# Altium project UHF Transceiver.PrjPCB (part 2 of 3)

## Sheet ADF7021 Transceiver.SchDoc: ADF7021 Transceiver
size Letter; SheetNumber: 2; SheetTotal: 11
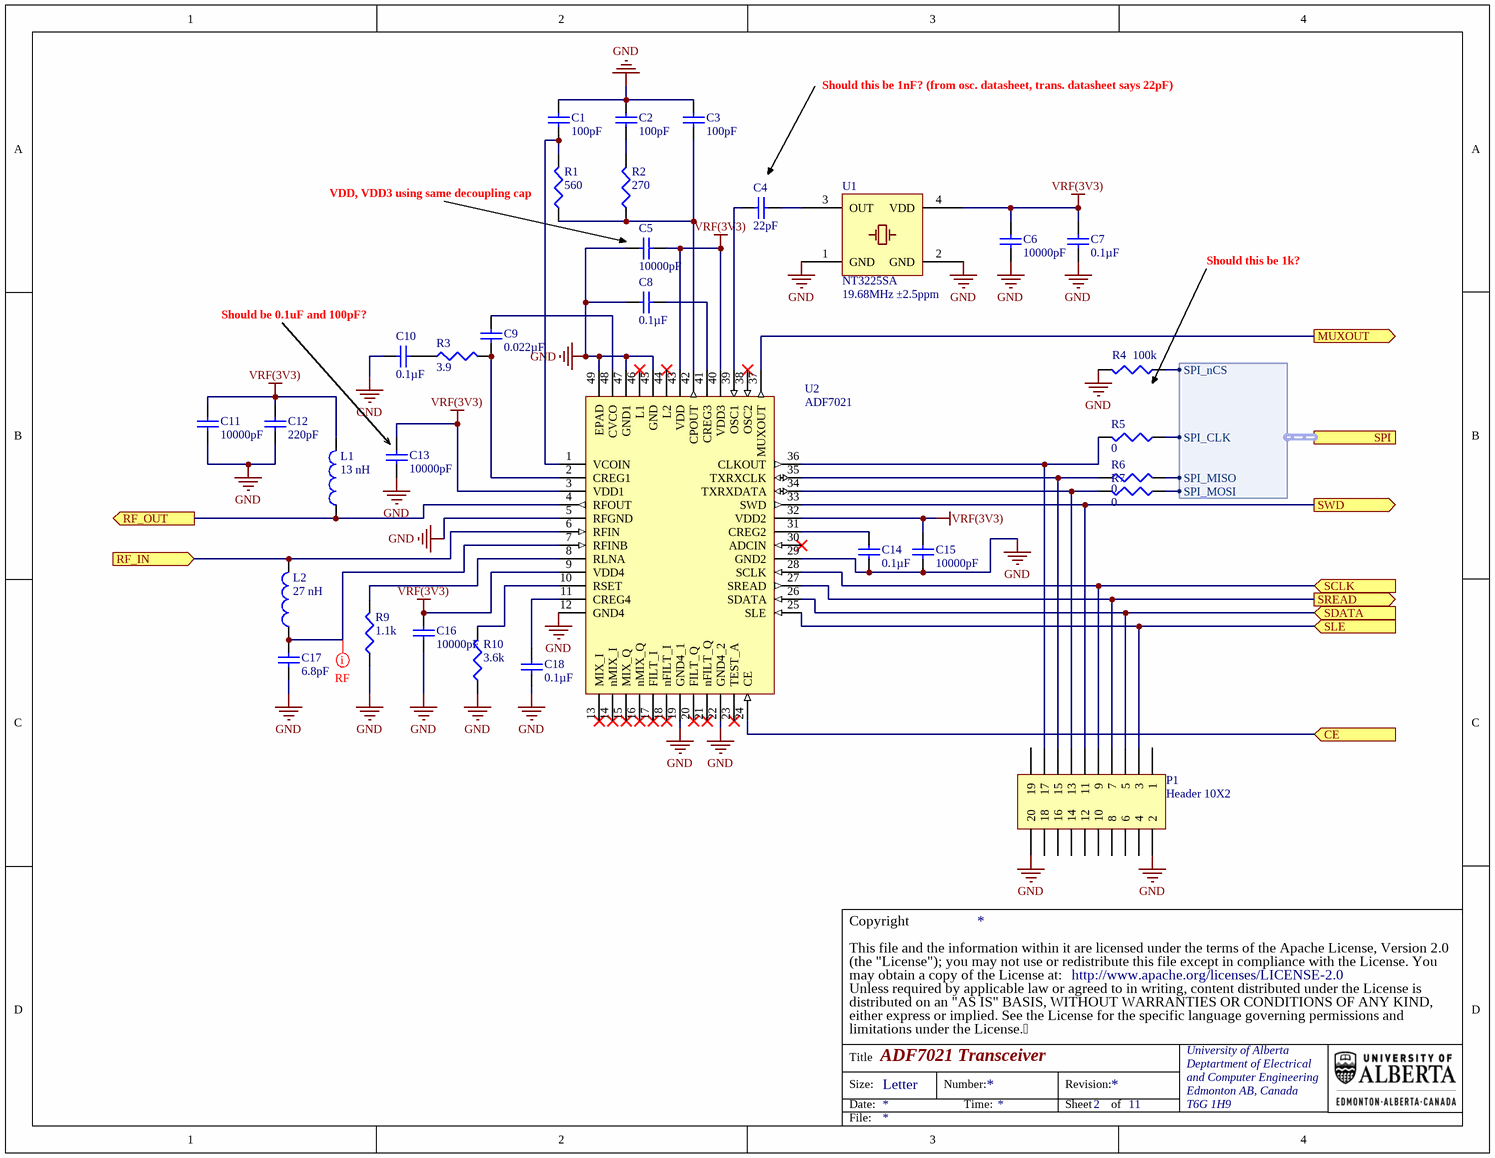
[diagram p3: ADF7021 Transceiver.SchDoc]

### Parts
C1  value 100pF  [TDK-CGA2B]  (hidden comment: Cap)
C2  value 100pF  [TDK-CGA2B]  (hidden comment: Cap)
C3  value 100pF  [TDK-CGA2B]  (hidden comment: Cap)
C4  value 22pF  [ATC-600L]  (hidden comment: Cap)
C5  value 10000pF  [TDK-CGA2B]  (hidden comment: Cap)
C6  value 10000pF  [TDK-CGA2B]  (hidden comment: Cap)
C7  value 0.1µF  [TDK-CGA2B]  (hidden comment: Cap)
C8  value 0.1µF  [TDK-CGA2B]  (hidden comment: Cap)
C9  value 0.022µF  [TDK-CGA2B]  (hidden comment: Cap)
C10  value 0.1µF  [TDK-CGA2B]  (hidden comment: Cap)
C11  value 10000pF  [TDK-CGA2B]  (hidden comment: Cap)
C12  value 220pF  [TDK-CGA2B]  (hidden comment: Cap)
C13  value 10000pF  [TDK-CGA2B]  (hidden comment: Cap)
C14  value 0.1µF  [TDK-CGA2B]  (hidden comment: Cap)
C15  value 10000pF  [TDK-CGA2B]  (hidden comment: Cap)
C16  value 10000pF  [TDK-CGA2B]  (hidden comment: Cap)
C17  value 6.8pF  [ATC-600L]  (hidden comment: Cap)
C18  value 0.1µF  [TDK-CGA2B]  (hidden comment: Cap)
L1  value 13 nH  [CCI-0402CS]  (hidden comment: 0402CS-13NXJLU)
L2  value 27 nH  [CCI-0402CS]  (hidden comment: 0402CS-27NXJLU)
P1  Header 10X2  [MOLX-0555600207]
R1  value 560  [PANA-ERA2A]  (hidden comment: Res3)
R2  value 270  [PANA-ERA2A]  (hidden comment: Res3)
R3  value 3.9  [VSH-CRCW0402]  (hidden comment: Res3)
R4  value 100k  [PANA-ERJ2R]  (hidden comment: Res3)
R5  value 0  [PANA-ERJ2G]  (hidden comment: Jumper)
R6  value 0  [PANA-ERJ2G]  (hidden comment: Jumper)
R7  value 0  [PANA-ERJ2G]  (hidden comment: Jumper)
R9  value 1.1k  [PANA-ERA2A]  (hidden comment: Res3)
R10  value 3.6k  [PANA-ERA2A]  (hidden comment: Res3)
U1  NT3225SA  value 19.68MHz  Frequency Stability: ±2.5ppm  [NDK-NT3225SA]
U2  ADF7021  [ADI-CP-48-5]

### Ports
CE (in), MUXOUT (out), RF_IN (in), RF_OUT (out), SCLK (in), SDATA (in), SLE (in), SPI (harness ADF7021_SPI), SREAD (out), SWD (out)

### Harnesses
ADF7021_SPI: SPI_MOSI, SPI_MISO, SPI_nCS, SPI_CLK

### Nets
GND: C1.2 C2.2 C3.2 C5.1 C6.1 C7.1 C8.2 C10.2 C11.1 C12.1 C13.1 C14.2 C15.1 C16.1 C17.1 C18.2 P1.2 P1.20 R4.2 R9.1 R10.1 U1.1(GND) U1.2(GND) U2.5(RFGND) U2.12(GND4) U2.19(GND4_1) U2.22(GND4_2) U2.29(GND2) U2.45(GND) U2.47(GND1) U2.49(EPAD)
VRF(3V3): C5.2 C6.2 C7.2 C11.2 C12.2 C13.2 C15.2 C16.2 L1.2 U1.4(VDD) U2.3(VDD1) U2.9(VDD4) U2.32(VDD2) U2.40(VDD3) U2.43(VDD)
ECAP6: R4.1 ; port SPI.SPI_nCS
EPWM1A: U2.24(CE) ; port CE
EPWM1B: P1.5 U2.26(SDATA) ; port SDATA
EPWM2A: P1.3 U2.25(SLE) ; port SLE
EQEP2I: U2.37(MUXOUT) ; port MUXOUT
GIOA0: P1.7 U2.27(SREAD) ; port SREAD
GIOA1: P1.11 U2.33(SWD) ; port SWD
GIOB0: P1.9 U2.28(SCLK) ; port SCLK
P93: R7.1 ; port SPI.SPI_MOSI
P94: R6.2 ; port SPI.SPI_MISO
P95: R5.1 ; port SPI.SPI_CLK
NetC1_1: C1.1 R1.2 U2.1(VCOIN)
NetC2_1: C2.1 R2.2
NetC3_1: C3.1 R1.1 R2.1 U2.42(CPOUT)
NetC4_1: C4.1 U2.39(OSC1)
NetC4_2: C4.2 U1.3(OUT)
NetC8_1: C8.1 U2.41(CREG3)
NetC9_1: C9.1 R3.2 U2.2(CREG1)
NetC9_2: C9.2 U2.48(CVCO)
NetC10_1: C10.1 R3.1
NetC14_1: C14.1 U2.31(CREG2)
NetC17_2: C17.2 L2.1 U2.7(RFINB)
NetC18_1: C18.1 U2.11(CREG4)
NetC52_2: L2.2 U2.6(RFIN) ; port RF_IN
NetC56_2: L1.1 U2.4(RFOUT) ; port RF_OUT
NetP1_13: P1.13 R7.2 U2.34(TXRXDATA)
NetP1_15: P1.15 R6.1 U2.35(TXRXCLK)
NetP1_17: P1.17 R5.2 U2.36(CLKOUT)
NetR9_2: R9.2 U2.8(RLNA)
NetR10_2: R10.2 U2.10(RSET)

Not connected (* = marked no-connect by the designer): P1 1 4 6 8 10 12 14 16 18 19; U2 13(MIX_I)* 14(nMIX_I)* 15(MIX_Q)* 16(nMIX_Q)* 17(FILT_I)* 18(nFILT_I)* 20(FILT_Q)* 21(nFILT_Q)* 23(TEST_A)* 30(ADCIN)* 38(OSC2)* 44(L2)* 46(L1)*

### Layout directives
net class RF; rule Impedance Constraint [Min = 50.00    Max = 50.00    ]: NetC17_2

### Notes on the sheet
- Should this be 1nF? (from osc. datasheet, trans. datasheet says 22pF)
- (near R1) VDD, VDD3 using same decoupling cap
- Should this be 1k?
- (near C10) Should be 0.1uF and 100pF?
- (the "License"); you may not use or redistribute this file except in compliance with the License. You
- This file and the information within it are licensed under the terms of the Apache License, Version 2.0
- Copyright
- Unless required by applicable law or agreed to in writing, content distributed under the License is
- distributed on an "AS IS" BASIS, WITHOUT WARRANTIES OR CONDITIONS OF ANY KIND,
- either express or implied. See the License for the specific language governing permissions and
- limitations under the License.
- may obtain a copy of the License at:
- http://www.apache.org/licenses/LICENSE-2.0
- Title
- Size:
- Date:
- Letter
- Number:
- Time:
- Revision:
- Sheet
- of
- University of Alberta
- Deptartment of Electrical
- and Computer Engineering
- Edmonton AB, Canada
- T6G 1H9
- File:

### Library data of the parts
C1-C3 = PC-TDK-01226: CAP CER 100PF 100V C0G 0402; Manufacturer Part Number: CGA2B2C0G2A101J050BA; Index: 1226; Designator: C?; Tolerance: ±5%; Temperature Coefficient: NP0; Published: 2016-03-16; LatestRevisionDate: 2016-03-16; LatestRevisionNote: ...; PackageReference: 0402 (1005 Metric); Publisher: AlbertaSat; PackageDescription: Radial Cap, Thru-Hole; 2 Leads; 0.3 in Pin Spacing; Part Number: PC-TDK-01226; Supplier Part Number 1: 445-15510-1-ND; Supplier 1: Digi-key; Supplier Link: http://www.digikey.ca/product-search/en?keywords=445-15510-1-ND; Voltage - Rated: 100V; Applications: Automotive
C4 = PC-ATC-00281: CAP CER 22PF 200V C0G/NP0 0402; Manufacturer Part Number: 600L220FT200T; Index: 281; Designator: C?; Tolerance: ±1%; Temperature Coefficient: C0G, NP0; Published: 2018-08-29; LatestRevisionDate: 2018-08-29; LatestRevisionNote: ...; PackageReference: 0402 (1005 Metric); Publisher: AlbertaSat; PackageDescription: Chip Capacitor, 2-Leads, Body 1.02x0.51mm, IPC Low Density; Part Number: PC-ATC-00281; Supplier Part Number 1: 1284-1114-1-ND; Supplier 1: Digi-key; Supplier Link: https://www.digikey.ca/products/en?keywords=1284-1114-1-ND; Voltage - Rated: 200V; Applications: High Q, Low Loss, Ultra Low ESR
C5 C6 C11 C13 C15 C16 = PC-TDK-01877: CAP CER 10000PF 50V X8R 0402; Manufacturer Part Number: CGA2B3X8R1H103K050BB; Index: 1877; Designator: C?; Tolerance: ±10%; Published: 2016-03-16; LatestRevisionDate: 2016-03-16; LatestRevisionNote: ...; PackageReference: 0402 (1005 Metric); Publisher: AlbertaSat; PackageDescription: Radial Cap, Thru-Hole; 2 Leads; 0.3 in Pin Spacing; Part Number: PC-TDK-01877; Supplier Part Number 1: 445-12303-1-ND; Supplier 1: Digi-key; Supplier Link: http://www.digikey.ca/product-search/en?keywords=445-12303-1-ND; Voltage - Rated: 50V; Temperature Coefficient: X8R; Applications: Automotive
C7 C8 C10 C14 C18 = PC-TDK-02259: CAP CER 0.1UF 50V X7R 0402; Manufacturer Part Number: CGA2B3X7R1H104K050BB; Index: 2259; Designator: C?; Tolerance: ±10%; Published: 2016-03-16; LatestRevisionDate: 2016-03-16; LatestRevisionNote: ...; PackageReference: 0402 (1005 Metric); Publisher: AlbertaSat; PackageDescription: Radial Cap, Thru-Hole; 2 Leads; 0.3 in Pin Spacing; Part Number: PC-TDK-02259; Supplier Part Number 1: 445-6899-1-ND; Supplier 1: Digi-key; Supplier Link: http://www.digikey.ca/product-search/en?keywords=445-6899-1-ND; Voltage - Rated: 50V; Temperature Coefficient: X7R; Applications: Automotive
C9 = PC-TDK-01998: CAP CER 0.022UF 50V X7R 0402; Manufacturer Part Number: CGA2B3X7R1H223K050BB; Index: 1998; Designator: C?; Tolerance: ±10%; Published: 2016-03-16; LatestRevisionDate: 2016-03-16; LatestRevisionNote: ...; PackageReference: 0402 (1005 Metric); Publisher: AlbertaSat; PackageDescription: Radial Cap, Thru-Hole; 2 Leads; 0.3 in Pin Spacing; Part Number: PC-TDK-01998; Supplier Part Number 1: 445-6895-1-ND; Supplier 1: Digi-key; Supplier Link: http://www.digikey.ca/product-search/en?keywords=445-6895-1-ND; Voltage - Rated: 50V; Temperature Coefficient: X7R; Applications: Automotive
C12 = PC-TDK-01303: CAP CER 220PF 50V NP0 0402; Manufacturer Part Number: CGA2B2NP01H221J050BA; Index: 1303; Designator: C?; Tolerance: ±5%; Published: 2016-03-16; LatestRevisionDate: 2016-03-16; LatestRevisionNote: ...; PackageReference: 0402 (1005 Metric); Publisher: AlbertaSat; PackageDescription: Radial Cap, Thru-Hole; 2 Leads; 0.3 in Pin Spacing; Part Number: PC-TDK-01303; Supplier Part Number 1: 445-12129-1-ND; Supplier 1: Digi-key; Supplier Link: http://www.digikey.ca/product-search/en?keywords=445-12129-1-ND; Voltage - Rated: 50V; Temperature Coefficient: NP0; Applications: Automotive
C17 = PC-ATC-00200: CAP CER 6.8PF 200V C0G/NP0 0402; Manufacturer Part Number: 600L6R8BT200T; Index: 200; Designator: C?; Tolerance: ±0.1pF; Temperature Coefficient: C0G, NP0; Published: 2018-08-29; LatestRevisionDate: 2018-08-29; LatestRevisionNote: ...; PackageReference: 0402 (1005 Metric); Publisher: AlbertaSat; PackageDescription: Chip Capacitor, 2-Leads, Body 1.02x0.51mm, IPC Low Density; Part Number: PC-ATC-00200; Supplier Part Number 1: 1284-1134-1-ND; Supplier 1: Digi-key; Supplier Link: https://www.digikey.ca/products/en?keywords=1284-1134-1-ND; Voltage - Rated: 200V; Applications: High Q, Low Loss, Ultra Low ESR
L1 = PL-CCI-00008: Fixed Inductors 0402CS AEC-Q200 13 nH 5 % 0.44 A; Code_IEC: 1005; Index: 8; Designator: L?; Published: 2018-06-17; LatestRevisionDate: 2018-06-17; LatestRevisionNote: ...; PackageReference: 0402 (1005 Metric); Publisher: AlbertaSat; PackageDescription: Chip Inductor, 2-Leads, Body 1.02x0.51mm, IPC Low Density; Code_JEITA: 0402; Part Number: PL-CCI-00008; Manufacturer Part Number: 0402CS-13NXJLU; Supplier Part Number 1: 994-0402CS-13NXJLU; Supplier 1: Mouser; Supplier Part Number 2: 0402CS-13NXJLU; Supplier 2: Coilcraft Direct; Supplier Link: #https://www.mouser.ca/ProductDetail/Coilcraft/0402CS-13NXJLU?qs=sGAEpiMZZMsg%252by3WlYCkU2kWFds1hA9D8Sdb1F7tpJw=#
L2 = PL-CCI-00009: Fixed Inductors 0402CS AEC-Q200 27 nH 5 % 0.4 A / Fixed Inductors 0402CS AEC-Q200 27 nH 5 % 0.4 A; Code_IEC: 1005; Index: 9; Designator: L?; Published: 2018-06-17; LatestRevisionDate: 2018-06-17; LatestRevisionNote: ...; PackageReference: 0402 (1005 Metric); Publisher: AlbertaSat; PackageDescription: Chip Inductor, 2-Leads, Body 1.02x0.51mm, IPC Low Density; Code_JEITA: 0402; Part Number: PL-CCI-00009; Manufacturer Part Number: 0402CS-27NXJLU; Supplier Part Number 1: 994-0402CS-27NXJLU; Supplier 1: Mouser; Supplier Part Number 2: 0402CS-27NXJLU; Supplier 2: Coilcraft Direct; Supplier Link: #https://www.mouser.ca/ProductDetail/Coilcraft/0402CS-27NXJLU?qs=sGAEpiMZZMsg%252by3WlYCkU2kWFds1hA9DQUyEMcwWJWI%3d#
P1 = 50: CONN PLUG 20POS 1.5MM SMD .5MM; Part Number: 50; Manufacturer Part Number: 0555600207; Designator: P?; LatestRevisionDate: 17-Jul-2002; LatestRevisionNote: Re-released for DXP Platform.; Publisher: Altium Limited; Supplier Part Number 1: WM9217CT-ND; Supplier 1: Digi-Key; Supplier Link: #https://www.digikey.ca/product-detail/en/molex-llc/0555600207/WM9217CT-ND/1025137#; PackageReference: MOLX-0555600207
R1 = 15042: RES SMD 560 OHM 0.1% 1/16W 0402; Part Number: 15042; Manufacturer Part Number: ERA-2ARB561X; Designator: R?; Power: 0.063W, 1/16W; Temperature Coefficient: ±10ppm/°C; Published: 8-Jun-2000; LatestRevisionDate: 29-May-2009; LatestRevisionNote: IPC-7351 Footprint Added.; PackageReference: 0402 (1005 Metric); Publisher: Altium Limited; PackageDescription: Chip Resistor, 2-Leads, Body 1.00x0.50mm, IPC Low Density; Supplier Part Number 1: P560CPCT-ND; Supplier 1: Digi-Key; Supplier Link: http://www.digikey.ca/product-search/en?keywords=P560CPCT-ND; Tolerance: ±0.1%
R2 = 14593: RES SMD 270 OHM 0.1% 1/16W 0402; Part Number: 14593; Manufacturer Part Number: ERA-2ARB271X; Designator: R?; Power: 0.063W, 1/16W; Temperature Coefficient: ±10ppm/°C; Published: 8-Jun-2000; LatestRevisionDate: 29-May-2009; LatestRevisionNote: IPC-7351 Footprint Added.; PackageReference: 0402 (1005 Metric); Publisher: Altium Limited; PackageDescription: Chip Resistor, 2-Leads, Body 1.00x0.50mm, IPC Low Density; Supplier Part Number 1: P270CPCT-ND; Supplier 1: Digi-Key; Supplier Link: http://www.digikey.ca/product-search/en?keywords=P270CPCT-ND; Tolerance: ±0.1%
R3 = PR-VSH-00269: RES SMD 3.9 OHM 1% 1/16W 0402; Manufacturer Part Number: CRCW04023R90FKED; Index: 269; Designator: R?; Power - Rated: 0.063W; Temperature Coefficient: ±100ppm/°C; Published: 2018-12-11; LatestRevisionDate: 2018-12-11; LatestRevisionNote: ...; PackageReference: 0402 (1005 Metric); Publisher: AlbertaSat; PackageDescription: Chip Resistor, 2-Leads, Body 1.00x0.50mm, IPC Low Density; Part Number: PR-VSH-00269; Supplier Part Number 1: 541-3.90LLCT-ND; Supplier 1: Digi-key; Supplier Part Number 2: 71-CRCW04023R90FKED; Supplier 2: Mouser; Supplier Link: #https://www.digikey.ca/product-detail/en/vishay-dale/CRCW04023R90FKED/541-3.90LLCT-ND/1961949#; Tolerance: ±1%; Applications: Automotive
R4 = 18739: RES SMD 100K OHM 1% 1/10W 0402; Part Number: 18739; Manufacturer Part Number: ERJ-2RKF1003X; Designator: R?; Power: 0.1W, 1/10W; Temperature Coefficient: ±100ppm/°C; Published: 8-Jun-2000; LatestRevisionDate: 29-May-2009; LatestRevisionNote: IPC-7351 Footprint Added.; PackageReference: 0402 (1005 Metric); Publisher: Altium Limited; PackageDescription: Chip Resistor, 2-Leads, Body 1.00x0.50mm, IPC Low Density; Supplier Part Number 1: P100KLCT-ND; Supplier 1: Digi-Key; Supplier Link: http://www.digikey.ca/product-search/en?keywords=P100KLCT-ND; Tolerance: ±1%
R5-R7 = 13127: RES SMD 0.0OHM JUMPER 1/10W 0402; Part Number: 13127; Manufacturer Part Number: ERJ-2GE0R00X; Designator: R?; Power: 0.1W, 1/10W; PackageDescription: Chip Resistor, 2-Leads, Body 1.00x0.50mm, IPC Low Density; Supplier Part Number 1: P0.0JCT-ND; Supplier 1: Digi-Key; Supplier Link: http://www.digikey.ca/product-search/en?keywords=P0.0JCT-ND; PackageReference: 0402 (1005 Metric); Tolerance: Jumper; Temperature Coefficient: -; Type: Jumper
R9 = 15460: RES SMD 1.1K OHM 0.1% 1/16W 0402; Part Number: 15460; Manufacturer Part Number: ERA-2ARB112X; Designator: R?; Power: 0.063W, 1/16W; Temperature Coefficient: ±10ppm/°C; Published: 8-Jun-2000; LatestRevisionDate: 29-May-2009; LatestRevisionNote: IPC-7351 Footprint Added.; PackageReference: 0402 (1005 Metric); Publisher: Altium Limited; PackageDescription: Chip Resistor, 2-Leads, Body 1.00x0.50mm, IPC Low Density; Supplier Part Number 1: P1.1KCPCT-ND; Supplier 1: Digi-Key; Supplier Link: http://www.digikey.ca/product-search/en?keywords=P1.1KCPCT-ND; Tolerance: ±0.1%
R10 = 16432: RES SMD 3.6K OHM 0.1% 1/16W 0402; Part Number: 16432; Manufacturer Part Number: ERA-2ARB362X; Designator: R?; Power: 0.063W, 1/16W; Temperature Coefficient: ±10ppm/°C; Published: 8-Jun-2000; LatestRevisionDate: 29-May-2009; LatestRevisionNote: IPC-7351 Footprint Added.; PackageReference: 0402 (1005 Metric); Publisher: Altium Limited; PackageDescription: Chip Resistor, 2-Leads, Body 1.00x0.50mm, IPC Low Density; Supplier Part Number 1: P3.6KCPCT-ND; Supplier 1: Digi-Key; Supplier Link: http://www.digikey.ca/product-search/en?keywords=P3.6KCPCT-ND; Tolerance: ±0.1%
U1 = PU-NDK-00001: OSC VCTCXO 19.68MHZ SMD; Manufacturer Part Number: NT3225SA-19.680000MHZ; Index: 1; Designator: U?; Voltage - Supply: 3V; Current - Supply (Max): 1.5mA; Part Number: PU-NDK-00001; Supplier Part Number 1: 644-1088-1-ND; Supplier 1: Digi-key; Supplier Part Number 2: NT3225SA-19.680000MHZ; Supplier 2: Excess Parts; Publisher: AlbertaSat; Published: 2018-09-04; LatestRevisionDate: 2018-09-04; LatestRevisionNote: ...; PackageReference: 4-SMD, No Lead; PackageDescription: 4-SMD, No Lead, 0.126" L x 0.098" W x 0.039" H (3.20mm x 2.50mm x 1.00mm); Supplier Link: #https://www.digikey.ca/products/en?keywords=644-1088-1-ND#; Operating Temperature: -30°C ~ 75°C
U2 = PU-ADI-00005: IC RF TXRX ISM<1GHZ 48-VFQFN; Manufacturer_Name: Analog Devices; Manufacturer Part Number: ADF7021BCPZ-RL; Geometry.Height: 0.8mm; Index: 5; Designator: U?; Supplier_Name: RS; RS Part Number: 6977565; Manufacturer_Part_Number: ADF7021BCPZ; Allied_Number: *; Other Part Number: *; Datasheet Link: http://www.analog.com/static/imported-files/data_sheets/ADF7021.pdf; 3D Package: *; Part Number: PU-ADI-00005; Supplier Part Number 1: ADF7021BCPZ-RLCT-ND; Supplier 1: Digi-key; Supplier Part Number 2: 584-ADF7021BCPZ-R; Supplier 2: Mouser; Publisher: AlbertaSat; Published: 2018-02-06; LatestRevisionDate: 2018-02-06; LatestRevisionNote: ...; PackageReference: 48-VFQFN; PackageDescription: PQFN, 48-Leads, Body 7.00x7.00mm, Pitch 0.50mm, Thermal Pad 4.10x4.10mm, IPC Medium Density; Supplier Link: #https://www.digikey.ca/product-detail/en/analog-devices-inc/ADF7021BCPZ-RL/ADF7021BCPZ-RLCT-ND/4162134#

## Sheet RTCMK RTC.SchDoc: RTCMK RTC
size Letter; SheetNumber: 4; SheetTotal: 11
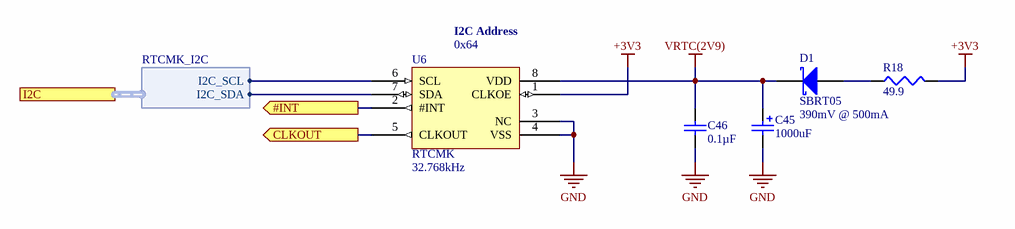
[diagram p4: RTCMK RTC.SchDoc]

### Parts
C45  value 1000uF  [AVX-F722824M]  (hidden comment: Cap Pol1)
C46  value 0.1µF  [TDK-CGA2B]  (hidden comment: Cap)
D1  SBRT05  Voltage - Forward (Max): 390mV @ 500mA  [DIOD-X2-DFN1006-2]
R18  value 49.9  [PANA-ERJ2R]  (hidden comment: Res3)
U6  RTCMK  value 32.768kHz  [ABR-RTCMK]

### Ports
#INT (out), CLKOUT (out), I2C (harness RTCMK_I2C)

### Harnesses
RTCMK_I2C: I2C_SCL, I2C_SDA

### Nets
+3V3: R18.2 U6.1(CLKOE)  [project net POWER19]
GND: C45.2 C46.2 U6.3(NC) U6.4(VSS)
VRTC(2V9): C45.1 C46.1 D1.2(K) U6.8(VDD)
EPWM3A: U6.5(CLKOUT) ; port CLKOUT
GIOB1: U6.2(#INT) ; port #INT
I2C_SCL: U6.6(SCL) ; port I2C.I2C_SCL
I2C_SDA: U6.7(SDA) ; port I2C.I2C_SDA
NetD1_1: D1.1(A) R18.1

### Notes on the sheet
- (near U6) I2C Address
- (near U6) 0x64
- (the "License"); you may not use or redistribute this file except in compliance with the License. You
- This file and the information within it are licensed under the terms of the Apache License, Version 2.0
- Copyright
- Unless required by applicable law or agreed to in writing, content distributed under the License is
- distributed on an "AS IS" BASIS, WITHOUT WARRANTIES OR CONDITIONS OF ANY KIND,
- either express or implied. See the License for the specific language governing permissions and
- limitations under the License.
- may obtain a copy of the License at:
- http://www.apache.org/licenses/LICENSE-2.0
- Title
- Size:
- Date:
- Letter
- Number:
- Time:
- Revision:
- Sheet
- of
- University of Alberta
- Deptartment of Electrical
- and Computer Engineering
- Edmonton AB, Canada
- T6G 1H9
- File:

### Library data of the parts
C45 = PC-AVX-00233: CAP TANT 1000UF 10V 20% 2824; Manufacturer Part Number: F721A108MMCAQ2; Index: 233; Designator: C?; Equivalent Series Resistance: 140 mOhm @ 100kHz; Published: 2018-08-09; LatestRevisionDate: 2018-08-09; LatestRevisionNote: ...; PackageReference: 2824 (7260 metric); Publisher: AlbertaSat; PackageDescription: Chip Capacitor, 2-Leads, Body 7.20x6.00mm, IPC Low Density; Part Number: PC-AVX-00233; Supplier Part Number 1: 478-11457-1-ND; Supplier 1: Digi-key; Supplier Part Number 2: 581-F721A108MMCAQ2; Supplier 2: Mouser; Supplier Link: #https://www.digikey.ca/products/en?keywords=478-11457-1-ND#; Tolerance: ±20%; Voltage - Rated: 10V; Applications: General Purpose
C46 = PC-TDK-02259: as C7 on sheet ADF7021 Transceiver; Published: 2016-03-16; LatestRevisionDate: 2016-03-16; LatestRevisionNote: ...; PackageReference: 0402 (1005 Metric); Publisher: AlbertaSat; PackageDescription: Radial Cap, Thru-Hole; 2 Leads; 0.3 in Pin Spacing; Part Number: PC-TDK-02259; Supplier Part Number 1: 445-6899-1-ND; Supplier 1: Digi-key; Supplier Link: http://www.digikey.ca/product-search/en?keywords=445-6899-1-ND; Voltage - Rated: 50V; Temperature Coefficient: X7R; Applications: Automotive
D1 = 29: SUPER BARRIER RECTIFIER X2-DFN10; Part Number: 29; Manufacturer Part Number: SBRT05U20LPS-7B; Designator: D?; Published: 8-Jun-2000; LatestRevisionDate: 17-Jul-2002; LatestRevisionNote: Re-released for DXP Platform.; PackageReference: DFN 0402 (1006 Metric); Publisher: Altium Limited; PackageDescription: DO-214-AA/SMB; 2 C-Bend Leads; Body 5.3 x 3.6 mm, inc. leads (LxW); Code_JEDEC: DO-214-AA; Supplier Part Number 1: SBRT05U20LPS-7BDICT-ND; Supplier 1: Digi-Key; Supplier Part Number 2: 621-SBRT05U20LPS-7B; Supplier 2: Mouser; Supplier Link: #https://www.digikey.ca/products/en?keywords=SBRT05U20LPS-7BDICT-ND#
R18 = 13732: RES SMD 49.9 OHM 1% 1/10W 0402; Part Number: 13732; Manufacturer Part Number: ERJ-2RKF49R9X; Designator: R?; Power: 0.1W, 1/10W; Temperature Coefficient: ±100ppm/°C; Published: 8-Jun-2000; LatestRevisionDate: 29-May-2009; LatestRevisionNote: IPC-7351 Footprint Added.; PackageReference: 0402 (1005 Metric); Publisher: Altium Limited; PackageDescription: Chip Resistor, 2-Leads, Body 1.00x0.50mm, IPC Low Density; Supplier Part Number 1: P49.9LCT-ND; Supplier 1: Digi-Key; Supplier Link: http://www.digikey.ca/product-search/en?keywords=P49.9LCT-ND; Tolerance: ±1%
U6 = PU-ABR-00037: IC RTC CLK/CALENDAR I2C 8-SMT; Manufacturer Part Number: AB-RTCMK-32.768KHZ-T3; Index: 37; Part Number: PU-ABR-00037; Supplier Part Number 1: 535-11916-1-ND; Supplier 1: Digi-key; Supplier Part Number 2: 815-AB-RTCMK-32.7KT3; Supplier 2: Mouser; Publisher: AlbertaSat; Published: 2018-04-23; LatestRevisionDate: 2018-04-23; LatestRevisionNote: ...; PackageReference: 8-SMD Module; PackageDescription: 8-SMD Module; Supplier Link: https://www.digikey.ca/product-detail/en/abracon-llc/AB-RTCMK-32.768KHZ-T3/535-11916-1-ND/3601050

## Sheet Stack Header.SchDoc: Stack Header
size Letter; SheetNumber: 11; SheetTotal: 11
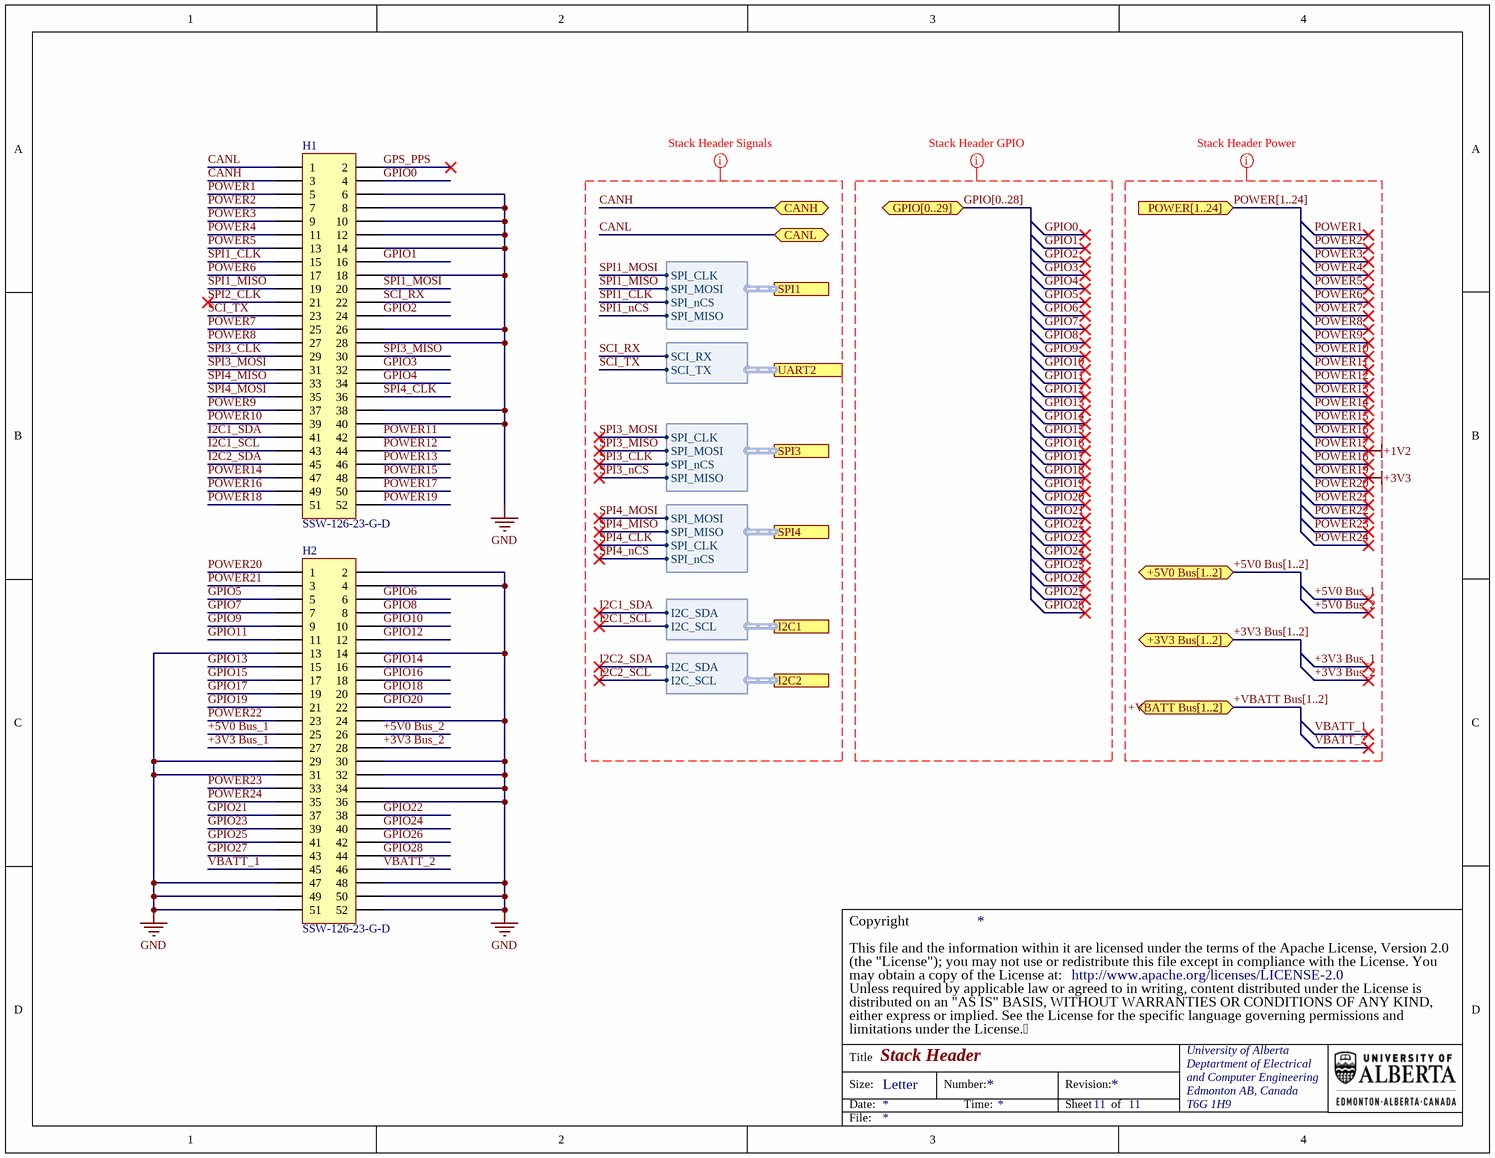
[diagram p5: Stack Header.SchDoc]

### Parts
H1  SSW-126-23-G-D  [SSW-126-23-G-D]
H2  SSW-126-23-G-D  [SSW-126-23-G-D]

### Ports
+3V3 Bus[1..2] (bidir), +5V0 Bus[1..2] (bidir), +VBATT Bus[1..2] (bidir), CANH (bidir), CANL (bidir), GPIO[0..29] (bidir), I2C1 (harness STACK_I2C1), I2C2 (harness STACK_I2C0), POWER[1..24] (in), SPI1 (harness STACK_SPI1), SPI3 (harness STACK_SPI3), SPI4 (harness STACK_SPI0), UART2 (harness STACK_UART2)

### Harnesses
STACK_SPI1: SPI_MOSI, SPI_MISO, SPI_CLK, SPI_nCS
STACK_I2C0: I2C_SDA, I2C_SCL
STACK_I2C1: I2C_SDA, I2C_SCL
STACK_UART2: SCI_RX, SCI_TX
STACK_SPI3: SPI_MOSI, SPI_MISO, SPI_CLK, SPI_nCS
STACK_SPI0: SPI_MOSI, SPI_MISO, SPI_CLK, SPI_nCS

### Nets
GND: H1.6 H1.8 H1.10 H1.12 H1.14 H1.18 H1.26 H1.28 H1.38 H1.40 H2.2 H2.4 H2.13 H2.14 H2.24 H2.29 H2.30 H2.31 H2.32 H2.34 H2.36 H2.47 H2.48 H2.49 H2.50 H2.51 H2.52
POWER17: H1.50  [also labelled +1V2]
POWER19: H1.52  [also labelled +3V3]
+3V3 Bus_1: H2.27
+3V3 Bus_2: H2.28
+5V0 Bus_1: H2.25
+5V0 Bus_2: H2.26
CANH: H1.3 ; port CANH  [project net CAN_P]
CANL: H1.1 ; port CANL  [project net CAN_N]
GPIO0: H1.4
GPIO1: H1.16
GPIO2: H1.24
GPIO3: H1.32
GPIO4: H1.34
GPIO5: H2.5
GPIO6: H2.6
GPIO7: H2.7
GPIO8: H2.8
GPIO9: H2.9
GPIO10: H2.10
GPIO11: H2.11
GPIO12: H2.12
GPIO13: H2.15
GPIO14: H2.16
GPIO15: H2.17
GPIO16: H2.18
GPIO17: H2.19
GPIO18: H2.20
GPIO19: H2.21
GPIO20: H2.22
GPIO21: H2.37
GPIO22: H2.38
GPIO23: H2.39
GPIO24: H2.40
GPIO25: H2.41
GPIO26: H2.42
GPIO27: H2.43
GPIO28: H2.44
GPS_PPS: H1.2
I2C1_SCL: H1.43 ; port I2C1.I2C_SCL
I2C1_SDA: H1.41 ; port I2C1.I2C_SDA
I2C2_SCL: port I2C2.I2C_SCL
I2C2_SDA: H1.45 ; port I2C2.I2C_SDA
POWER1: H1.5
POWER2: H1.7
POWER3: H1.9
POWER4: H1.11
POWER5: H1.13
POWER6: H1.17
POWER7: H1.25
POWER8: H1.27
POWER9: H1.37
POWER10: H1.39
POWER11: H1.42
POWER12: H1.44
POWER13: H1.46
POWER14: H1.47
POWER15: H1.48
POWER16: H1.49
POWER18: H1.51
POWER20: H2.1
POWER21: H2.3
POWER22: H2.23
POWER23: H2.33
POWER24: H2.35
SCI_RX: H1.22 ; port UART2.SCI_RX  [project net EPWM5A]
SCI_TX: H1.23 ; port UART2.SCI_TX  [project net EPWM5B]
SPI1_CLK: H1.15 ; port SPI1.SPI_nCS  [project net EPWM4A]
SPI1_MISO: H1.19 ; port SPI1.SPI_MOSI  [project net P99]
SPI1_MOSI: H1.20 ; port SPI1.SPI_CLK  [project net P100]
SPI2_CLK: H1.21
SPI3_CLK: H1.29 ; port SPI3.SPI_nCS
SPI3_MISO: H1.30 ; port SPI3.SPI_MOSI
SPI3_MOSI: H1.31 ; port SPI3.SPI_CLK
SPI3_nCS: port SPI3.SPI_MISO
SPI4_CLK: H1.36 ; port SPI4.SPI_CLK
SPI4_MISO: H1.33 ; port SPI4.SPI_MISO
SPI4_MOSI: H1.35 ; port SPI4.SPI_MOSI
SPI4_nCS: port SPI4.SPI_nCS
VBATT_1: H2.45
VBATT_2: H2.46

### Buses and harness runs
bus +3V3 Bus[1..2] = port +3V3 Bus[1..2]
bus +5V0 Bus[1..2] = port +5V0 Bus[1..2]
bus +VBATT Bus[1..2] = port +VBATT Bus[1..2]
bus GPIO[0..28] = port GPIO[0..29]
bus POWER[1..24] = port POWER[1..24]

### Layout directives
mark named Stack Header Signals: CANH, CANL, I2C1_SCL, I2C1_SDA, I2C2_SCL, I2C2_SDA, SCI_RX, SCI_TX, SPI1_CLK, SPI1_MISO, SPI1_MOSI, SPI1_nCS, SPI3_CLK, SPI3_MISO, SPI3_MOSI, SPI3_nCS, SPI4_CLK, SPI4_MISO, SPI4_MOSI, SPI4_nCS
mark named Stack Header GPIO: GPIO0, GPIO1, GPIO2, GPIO3, GPIO4, GPIO5, GPIO6, GPIO7, GPIO8, GPIO9, GPIO10, GPIO11, GPIO12, GPIO13, GPIO14, GPIO15, GPIO16, GPIO17, GPIO18, GPIO19, GPIO20, GPIO21, GPIO22, GPIO23, GPIO24, GPIO25, GPIO26, GPIO27, GPIO28, GPIO[0..28]
mark named Stack Header Power: +1V2, +3V3, +3V3 Bus[1..2], +3V3 Bus_1, +3V3 Bus_2, +5V0 Bus[1..2], +5V0 Bus_1, +5V0 Bus_2, +VBATT Bus[1..2], POWER1, POWER2, POWER3, POWER4, POWER5, POWER6, POWER7, POWER8, POWER9, POWER10, POWER11, POWER12, POWER13, POWER14, POWER15, POWER16, POWER17, POWER18, POWER19, POWER20, POWER21, POWER22, POWER23, POWER24, POWER[1..24], VBATT_1, VBATT_2

### Notes on the sheet
- (the "License"); you may not use or redistribute this file except in compliance with the License. You
- This file and the information within it are licensed under the terms of the Apache License, Version 2.0
- Copyright
- Unless required by applicable law or agreed to in writing, content distributed under the License is
- distributed on an "AS IS" BASIS, WITHOUT WARRANTIES OR CONDITIONS OF ANY KIND,
- either express or implied. See the License for the specific language governing permissions and
- limitations under the License.
- may obtain a copy of the License at:
- http://www.apache.org/licenses/LICENSE-2.0
- Title
- Size:
- Date:
- Letter
- Number:
- Time:
- Revision:
- Sheet
- of
- University of Alberta
- Deptartment of Electrical
- and Computer Engineering
- Edmonton AB, Canada
- T6G 1H9
- File:

### Library data of the parts
H1 H2 = PP-SAM-00002: Index: 3; Designator: P?; Part Number: PP-SAM-00002; Manufacturer Part Number: SSW-126-23-G-D; Supplier Part Number 1: SSW-126-23-G-D; Supplier 1: Samtec; Publisher: AlbertaSat; Published: 2018-06-07; LatestRevisionDate: 2018-06-07; LatestRevisionNote: ...; Supplier Link: #https://www.samtec.com/products/ssw-126-23-g-d#

## Sheet MicroSD SPI Interface.SchDoc: EMIF06 SDIO Interface
size Letter; SheetNumber: 5; SheetTotal: 11
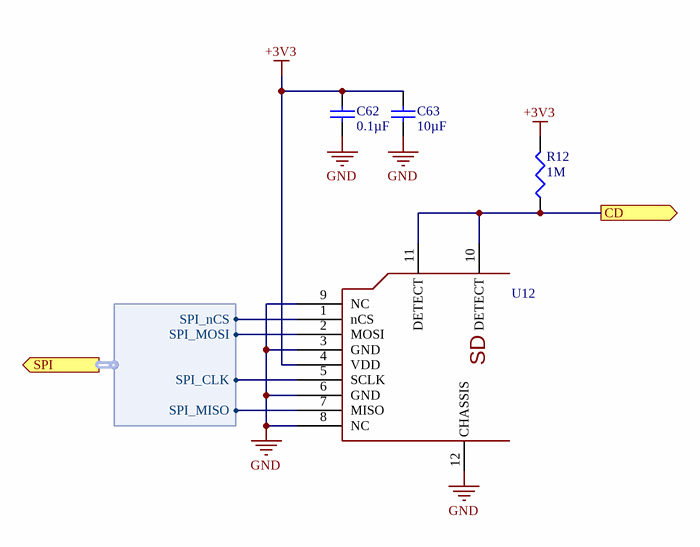
[diagram p6: MicroSD SPI Interface.SchDoc]

### Parts
C62  value 0.1µF  [TDK-CGA2B]  (hidden comment: Cap)
C63  value 10µF  [TDK-CGA5L]  (hidden comment: Cap)
R12  value 1M  [PANA-ERJ6EN]  (hidden comment: Res3)
U12  693063010911  [WL-693063010911]  (value not drawn)

### Ports
CD (out), SPI (out, harness MicroSD_SPI)

### Harnesses
MicroSD_SPI: SPI_CLK, SPI_nCS, SPI_MOSI, SPI_MISO

### Nets
+3V3: C62.1 C63.1 R12.2 U12.4(VDD)  [project net POWER19]
GND: C62.2 C63.2 U12.3(GND) U12.6(GND) U12.8(NC) U12.9(NC) U12.12(CHASSIS)
AD2EVT: U12.1(nCS) ; port SPI.SPI_nCS
AWM1_EXT_ENA: U12.7(MISO) ; port SPI.SPI_MISO
AWM1_EXT_SEL0: U12.2(MOSI) ; port SPI.SPI_MOSI
AWM1_EXT_SEL1: U12.5(SCLK) ; port SPI.SPI_CLK
CD: R12.1 U12.10(DETECT) U12.11(DETECT) ; port CD

### Notes on the sheet
- (the "License"); you may not use or redistribute this file except in compliance with the License. You
- This file and the information within it are licensed under the terms of the Apache License, Version 2.0
- Copyright
- Unless required by applicable law or agreed to in writing, content distributed under the License is
- distributed on an "AS IS" BASIS, WITHOUT WARRANTIES OR CONDITIONS OF ANY KIND,
- either express or implied. See the License for the specific language governing permissions and
- limitations under the License.
- may obtain a copy of the License at:
- http://www.apache.org/licenses/LICENSE-2.0
- Title
- Size:
- Date:
- Letter
- Number:
- Time:
- Revision:
- Sheet
- of
- University of Alberta
- Deptartment of Electrical
- and Computer Engineering
- Edmonton AB, Canada
- T6G 1H9
- File:
- (in symbol 56) SD

### Library data of the parts
C62 = PC-TDK-02259: as C7 on sheet ADF7021 Transceiver; Published: 2016-03-16; LatestRevisionDate: 2016-03-16; LatestRevisionNote: ...; PackageReference: 0402 (1005 Metric); Publisher: AlbertaSat; PackageDescription: Radial Cap, Thru-Hole; 2 Leads; 0.3 in Pin Spacing; Part Number: PC-TDK-02259; Supplier Part Number 1: 445-6899-1-ND; Supplier 1: Digi-key; Supplier Link: http://www.digikey.ca/product-search/en?keywords=445-6899-1-ND; Voltage - Rated: 50V; Temperature Coefficient: X7R; Applications: Automotive
C63 = PC-TDK-02917: CAP CER 10UF 25V X7R 1206; Manufacturer Part Number: CGA5L1X7R1E106K160AC; Index: 2917; Tolerance: ±10%; Published: 3/16/2016; LatestRevisionDate: 3/16/2016; LatestRevisionNote: ...; PackageReference: 1206 (3216 Metric); Publisher: AlbertaSat; PackageDescription: Radial Cap, Thru-Hole; 2 Leads; 0.3 in Pin Spacing; Part Number: PC-TDK-02917; Supplier Part Number 1: 445-6990-1-ND; Supplier 1: Digi-key; Supplier Link: http://www.digikey.ca/product-search/en?keywords=445-6990-1-ND; Voltage - Rated: 25V; Temperature Coefficient: X7R; Applications: Automotive
R12 = 19707: RES SMD 1M OHM 1% 1/8W 0805; Part Number: 19707; Manufacturer Part Number: ERJ-6ENF1004V; Power: 0.125W, 1/8W; Temperature Coefficient: ±100ppm/°C; Published: 8-Jun-2000; LatestRevisionDate: 29-May-2009; LatestRevisionNote: IPC-7351 Footprint Added.; PackageReference: 0805 (2012 Metric); Publisher: Altium Limited; PackageDescription: Chip Resistor, 2-Leads, Body 2.00x1.25mm, IPC Low Density; Supplier Part Number 1: P1.00MCCT-ND; Supplier 1: Digi-Key; Supplier Link: http://www.digikey.ca/product-search/en?keywords=P1.00MCCT-ND; Tolerance: ±1%
U12 = 56: CONN SD CARD PUSH-PULL R/A SMD; Part Number: 56; Designator: U?; Manufacturer Part Number: 693063010911; Supplier Part Number 1: 732-3817-1-ND; Supplier 1: Digi-Key; Supplier Part Number 2: 710-693063010911; Supplier 2: Mouser; Supplier Link: #https://www.digikey.ca/product-detail/en/wurth-electronics-inc/693063010911/732-3817-1-ND/3124599#

## Sheet Miscellaneous.SchDoc: Miscellaneous
size Letter; SheetNumber: 6; SheetTotal: 11
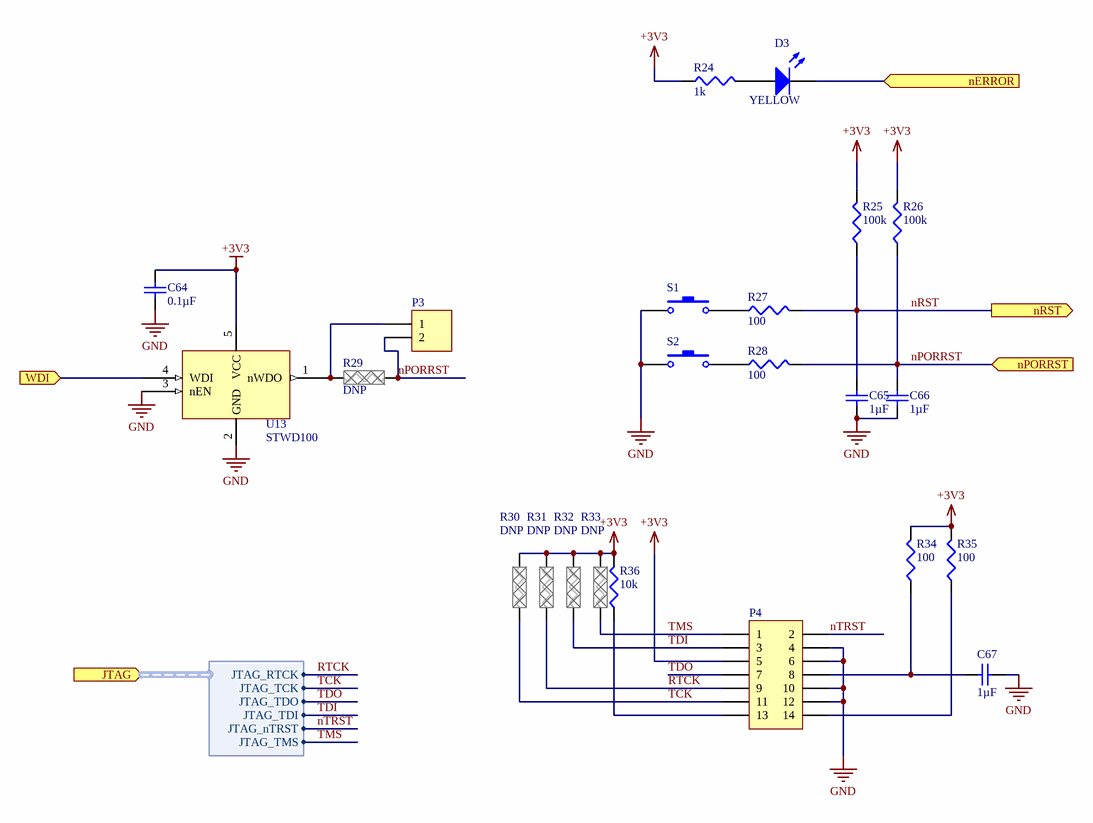
[diagram p7: Miscellaneous.SchDoc]

### Parts
C64  value 0.1µF  [TDK-CGA2B]  (hidden comment: Cap)
C65  value 1µF  [TDK-CGA3E]  (hidden comment: Cap)
C66  value 1µF  [TDK-CGA3E]  (hidden comment: Cap)
C67  value 1µF  [TDK-CGA3E]  (hidden comment: Cap)
D3  value YELLOW  [WL-150060XS75000]  (hidden comment: LED)
P3  Header 2  [SLN-GRPB021]  (value not drawn)
P4  Header 7x2  [HDR2X7]  (value not drawn)
R24  value 1k  [PANA-ERJ3EK]  (hidden comment: Res3)
R25  value 100k  [PANA-ERJ2R]  (hidden comment: Res3)
R26  value 100k  [PANA-ERJ2R]  (hidden comment: Res3)
R27  value 100  [PANA-ERJ2R]  (hidden comment: Res3)
R28  value 100  [PANA-ERJ2R]  (hidden comment: Res3)
R29  DNP  [PANA-ERA2A]  (no BOM)
R30  DNP  [PANA-ERA2A]  (no BOM)
R31  DNP  [PANA-ERA2A]  (no BOM)
R32  DNP  [PANA-ERA2A]  (no BOM)
R33  DNP  [PANA-ERA2A]  (no BOM)
R34  value 100  [PANA-ERJ2R]  (hidden comment: Res3)
R35  value 100  [PANA-ERJ2R]  (hidden comment: Res3)
R36  value 10k  [PANA-ERA2A]  (hidden comment: Res3)
S1  1825910-7  [TEC-1825910-7]  (value not drawn)
S2  1825910-7  [TEC-1825910-7]  (value not drawn)
U13  STWD100  [STM-SOT235]

### Ports
JTAG (in, harness TMS570_JTAG), nERROR (in), nPORRST (in), nRST (out), WDI (in)

### Harnesses
TMS570_JTAG: JTAG_TMS, JTAG_TCK, JTAG_TDO, JTAG_TDI, JTAG_nTRST, JTAG_RTCK

### Nets
+3V3: C64.1 P4.5 R24.1 R25.2 R26.2 R30.2 R31.2 R32.2 R33.2 R34.2 R35.2 R36.2 U13.5(VCC)  [project net POWER19]
GND: C64.2 C65.1 C66.1 C67.1 P4.4 P4.6 P4.10 P4.12 S1.1 S2.1 U13.2(GND) U13.3(nEN)
N2HET1_24: U13.4(WDI) ; port WDI
nERROR: D3.2(K) ; port nERROR
nPORRST: C66.2 P3.2 R26.1 R28.2 R29.1 ; port nPORRST
nRST: C65.2 R25.1 R27.2 ; port nRST
nTRST: P4.2 ; port JTAG.JTAG_nTRST
RTCK: P4.9 R31.1 ; port JTAG.JTAG_RTCK
TCK: P4.11 R30.1 ; port JTAG.JTAG_TCK
TDI: P4.3 R32.1 ; port JTAG.JTAG_TDI
TDO: P4.7 ; port JTAG.JTAG_TDO
TMS: P4.1 R33.1 ; port JTAG.JTAG_TMS
NetC67_2: C67.2 P4.8 R34.1
NetD3_1: D3.1(A) R24.2
NetP3_1: P3.1 R29.2 U13.1(nWDO)
NetP4_13: P4.13 R36.1
NetP4_14: P4.14 R35.1
NetR27_1: R27.1 S1.2
NetR28_1: R28.1 S2.2

### Notes on the sheet
- (the "License"); you may not use or redistribute this file except in compliance with the License. You
- This file and the information within it are licensed under the terms of the Apache License, Version 2.0
- Copyright
- Unless required by applicable law or agreed to in writing, content distributed under the License is
- distributed on an "AS IS" BASIS, WITHOUT WARRANTIES OR CONDITIONS OF ANY KIND,
- either express or implied. See the License for the specific language governing permissions and
- limitations under the License.
- may obtain a copy of the License at:
- http://www.apache.org/licenses/LICENSE-2.0
- Title
- Size:
- Date:
- Letter
- Number:
- Time:
- Revision:
- Sheet
- of
- University of Alberta
- Deptartment of Electrical
- and Computer Engineering
- Edmonton AB, Canada
- T6G 1H9
- File:

### Library data of the parts
C64 = PC-TDK-02259: as C7 on sheet ADF7021 Transceiver; Published: 2016-03-16; LatestRevisionDate: 2016-03-16; LatestRevisionNote: ...; PackageReference: 0402 (1005 Metric); Publisher: AlbertaSat; PackageDescription: Radial Cap, Thru-Hole; 2 Leads; 0.3 in Pin Spacing; Part Number: PC-TDK-02259; Supplier Part Number 1: 445-6899-1-ND; Supplier 1: Digi-key; Supplier Link: http://www.digikey.ca/product-search/en?keywords=445-6899-1-ND; Voltage - Rated: 50V; Temperature Coefficient: X7R; Applications: Automotive
C65-C67 = PC-TDK-02601: CAP CER 1UF 16V X5R 0603; Manufacturer Part Number: CGA3E1X5R1C105K080AC; Index: 2601; Designator: C?; Tolerance: ±10%; Published: 2016-03-16; LatestRevisionDate: 2016-03-16; LatestRevisionNote: ...; PackageReference: 0603 (1608 Metric); Publisher: AlbertaSat; PackageDescription: Radial Cap, Thru-Hole; 2 Leads; 0.3 in Pin Spacing; Part Number: PC-TDK-02601; Supplier Part Number 1: 445-12457-1-ND; Supplier 1: Digi-key; Supplier Link: http://www.digikey.ca/product-search/en?keywords=445-12457-1-ND; Voltage - Rated: 16V; Temperature Coefficient: X5R; Applications: Automotive
D3 = 5: LED YELLOW CLEAR 0603 SMD; Part Number: 5; Manufacturer Part Number: 150060YS75000; Designator: D?; Brightness: 120mcd; Published: 8-Jun-2000; LatestRevisionDate: 08-Jul-2005; LatestRevisionNote: Mech Layer 1 removed.; PackageReference: WL-150060XS75000; Publisher: Altium Limited; PackageDescription: LED; 2 Leads; Supplier Part Number 1: 732-4981-1-ND; Supplier 1: Digi-Key; Supplier Link: http://www.digikey.ca/product-search/en?keywords=732-4981-1-ND
P3 = PP-SLN-00001: CONN HEADER .050"" 3POS PCB GOLD; Manufacturer Part Number: GRPB021VWVN-RC; Index: 1; Designator: P?; Number of Positions: 2; Pitch: 0.050" (1.27mm); LatestRevisionDate: 2016-03-15; LatestRevisionNote: ...; Publisher: AlbertaSat; Part Number: PP-SLN-00001; Supplier Part Number 1: S9014E-02-ND; Supplier 1: Digi-key; Published: 2016-03-15; PackageReference: SLN-GRPB021; PackageDescription: CONN HEADER .050"" 3POS PCB GOLD; Supplier Link: http://www.digikey.ca/product-search/en?keywords=S9014E-02-ND; Number of Rows: 1
P4 = PP-SLN-00068: CONN HEADER .100"" DUAL STR 14POS; Manufacturer Part Number: PRPC007DAAN-RC; Index: 68; Designator: P?; Number of Positions: 14; Pitch: 0.100" (2.54mm); Post Length: 0.120" (3.05mm); Mating Length: 0.230" (5.84mm); LatestRevisionDate: 2017-03-17; LatestRevisionNote: ...; Publisher: AlbertaSat; Part Number: PP-SLN-00068; Supplier Part Number 1: S2011EC-07-ND; Supplier 1: Digi-key; Published: 2017-03-17; PackageReference: SLN-PRPC007DAA; PackageDescription: CONN HEADER .100"" DUAL STR 14POS; Supplier Link: http://www.digikey.ca/product-search/en?keywords=S2011EC-07-ND; Number of Rows: 2; Mounting Type: Through Hole
R24 = 15398: RES SMD 1K OHM 1% 1/10W 0603; Part Number: 15398; Manufacturer Part Number: ERJ-3EKF1001V; Designator: R?; Power: 0.1W, 1/10W; Temperature Coefficient: ±100ppm/°C; Published: 8-Jun-2000; LatestRevisionDate: 29-May-2009; LatestRevisionNote: IPC-7351 Footprint Added.; PackageReference: 0603 (1608 Metric); Publisher: Altium Limited; PackageDescription: Chip Resistor, 2-Leads, Body 1.60x0.80mm, IPC Low Density; Supplier Part Number 1: P1.00KHCT-ND; Supplier 1: Digi-Key; Supplier Link: http://www.digikey.ca/product-search/en?keywords=P1.00KHCT-ND; Tolerance: ±1%
R25 R26 = 18739: as R4 on sheet ADF7021 Transceiver; Published: 8-Jun-2000; LatestRevisionDate: 29-May-2009; LatestRevisionNote: IPC-7351 Footprint Added.; PackageReference: 0402 (1005 Metric); Publisher: Altium Limited; PackageDescription: Chip Resistor, 2-Leads, Body 1.00x0.50mm, IPC Low Density; Supplier Part Number 1: P100KLCT-ND; Supplier 1: Digi-Key; Supplier Link: http://www.digikey.ca/product-search/en?keywords=P100KLCT-ND; Tolerance: ±1%
R27 R28 R34 R35 = 14081: RES SMD 100 OHM 1% 1/10W 0402; Part Number: 14081; Manufacturer Part Number: ERJ-2RKF1000X; Designator: R?; Power: 0.1W, 1/10W; Temperature Coefficient: ±100ppm/°C; Published: 8-Jun-2000; LatestRevisionDate: 29-May-2009; LatestRevisionNote: IPC-7351 Footprint Added.; PackageReference: 0402 (1005 Metric); Publisher: Altium Limited; PackageDescription: Chip Resistor, 2-Leads, Body 1.00x0.50mm, IPC Low Density; Supplier Part Number 1: P100LCT-ND; Supplier 1: Digi-Key; Supplier Link: http://www.digikey.ca/product-search/en?keywords=P100LCT-ND; Tolerance: ±1%
R29-R33 = 19768: Part Number: 19768; Designator: R?; Value: DNP; PackageReference: 0402 (1005 Metric); PackageDescription: Chip Resistor, 2-Leads, Body 1.00x0.50mm, IPC Low Density
R36 = 17196: RES SMD 10K OHM 0.25% 1/16W 0402; Part Number: 17196; Manufacturer Part Number: ERA-2ARC103X; Designator: R?; Power: 0.063W, 1/16W; Temperature Coefficient: ±10ppm/°C; Published: 8-Jun-2000; LatestRevisionDate: 29-May-2009; LatestRevisionNote: IPC-7351 Footprint Added.; PackageReference: 0402 (1005 Metric); Publisher: Altium Limited; PackageDescription: Chip Resistor, 2-Leads, Body 1.00x0.50mm, IPC Low Density; Supplier Part Number 1: P10KCQCT-ND; Supplier 1: Digi-Key; Supplier Link: http://www.digikey.ca/product-search/en?keywords=P10KCQCT-ND; Tolerance: ±0.25%
S1 S2 = 452: SWITCH TACTILE SPST-NO 0.05A 24V; Part Number: 452; Designator: S?; Power (Watts): 1.2W; Published: 24-Mar-1999; LatestRevisionDate: 17-Jul-2002; LatestRevisionNote: Re-released for DXP Platform.; PackageReference: 1825910-7; Publisher: Altium Limited; PackageDescription: Tactile Switch SPST-NO Top Actuated Through Hole; Manufacturer Part Number: 1825910-7; Supplier Part Number 1: 450-1804-ND; Supplier 1: Digi-Key; Supplier Link: http://www.digikey.ca/product-search/en?keywords=450-1804-ND
U13 = PU-STM-00004: IC WATCHDOG TIME CIRCUIT SOT23-5; Manufacturer Part Number: STWD100YNWWY3F; Index: 4; Designator: U?; Value: 5.1 ms; Output Type: Open Drain; Part Number: PU-STM-00004; Supplier Part Number 1: 497-14864-1-ND; Supplier 1: Digi-key; Supplier Part Number 2: 511-STWD100YNWWY3F; Supplier 2: Mouser; Publisher: AlbertaSat; Published: 2017-04-06; LatestRevisionDate: 2017-04-06; LatestRevisionNote: ...; PackageReference: SOT-23-5; Supplier Link: https://www.digikey.ca/product-search/en?keywords=497-14864-1-ND

## Sheet TMS570LS0914_ports.SchDoc: TMS570LS0914 Ports
size Letter; SheetNumber: 7; SheetTotal: 11
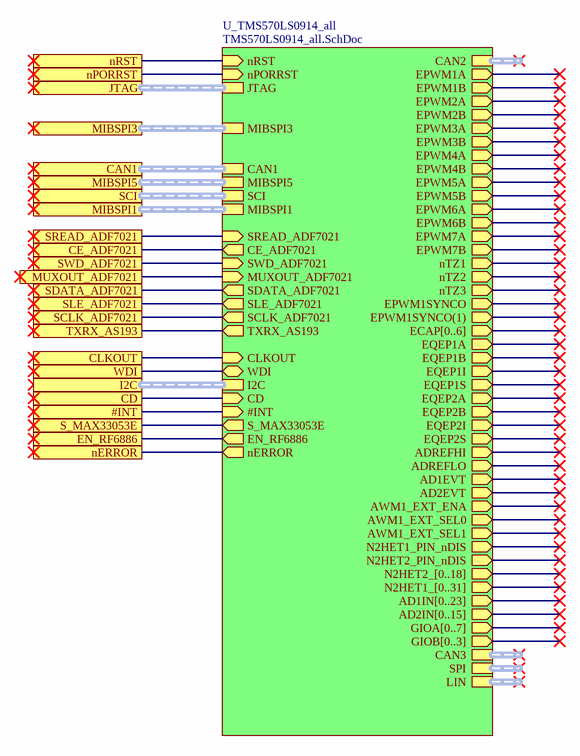
[diagram p8: TMS570LS0914_ports.SchDoc]

### Sub-sheets
U_TMS570LS0914_all = TMS570LS0914_all.SchDoc: nERROR (out), nRST (in), nPORRST (in), JTAG (harness TMS570_JTAG), CAN2 (harness TMS570_CAN2), CAN3 (harness TMS570_CAN3), EPWM1A (out), EPWM1B (out), EPWM2A (out), EPWM2B (out), EPWM3A (out), EPWM3B (out), EPWM4A (out), EPWM4B (out), EPWM5A (out), EPWM5B (out), EPWM6A (out), EPWM6B (out), EPWM7A (out), EPWM7B (out), nTZ1 (out), nTZ2 (out), nTZ3 (out), EPWM1SYNCO (out), EPWM1SYNCO(1) (out), ECAP[0..6] (out), EQEP1A (out), EQEP1B (out), EQEP1I (out), EQEP1S (out), EQEP2A (out), EQEP2B (out), EQEP2I (out), EQEP2S (out), MIBSPI3 (harness TMS570_MIBSPI3), LIN (harness TMS570_LIN), SPI (harness TMS570_SPI), CAN1 (harness TMS570_CAN1), MIBSPI5 (harness TMS570_MIBSPI5), SCI (harness TMS570_SCI), I2C (harness TMS570_I2C), MIBSPI1 (harness TMS570_MIBSPI1), ADREFHI (out), ADREFLO (out), AD1EVT (out), AD2EVT (out), AWM1_EXT_ENA (out), AWM1_EXT_SEL0 (out), AWM1_EXT_SEL1 (out), N2HET1_PIN_nDIS (out), N2HET2_PIN_nDIS (out), N2HET2_[0..18] (out), N2HET1_[0..31] (out), AD1IN[0..23] (out), AD2IN[0..15] (out), GIOA[0..7] (out), GIOB[0..3] (out), SREAD_ADF7021 (in), SWD_ADF7021 (in), MUXOUT_ADF7021 (in), CE_ADF7021 (out), SDATA_ADF7021 (out), SLE_ADF7021 (out), SCLK_ADF7021 (out), TXRX_AS193 (out), S_MAX33053E (out), EN_RF6886 (out), CD (in), #INT (in), CLKOUT (in), WDI (bidir)

### Ports
#INT, CAN1, CD, CE_ADF7021, CLKOUT, EN_RF6886, I2C (harness MCU_I2C0), JTAG, MIBSPI1, MIBSPI3, MIBSPI5, MUXOUT_ADF7021, nERROR, nPORRST, nRST, S_MAX33053E, SCI, SCLK_ADF7021, SDATA_ADF7021, SLE_ADF7021, SREAD_ADF7021, SWD_ADF7021, TXRX_AS193, WDI

### Nets
AD2EVT: sheet U_TMS570LS0914_all/EQEP1I, sheet U_TMS570LS0914_all/AD2EVT, sheet U_TMS570LS0914_all/N2HET2_PIN_nDIS
AWM1_EXT_SEL1: sheet U_TMS570LS0914_all/EQEP1A, sheet U_TMS570LS0914_all/AWM1_EXT_SEL1
CD: port CD, sheet U_TMS570LS0914_all/EPWM2B, sheet U_TMS570LS0914_all/CD
EPWM1A: port CE_ADF7021, sheet U_TMS570LS0914_all/EPWM1A, sheet U_TMS570LS0914_all/N2HET1_PIN_nDIS, sheet U_TMS570LS0914_all/CE_ADF7021
EPWM1B: port SDATA_ADF7021, sheet U_TMS570LS0914_all/EPWM1B, sheet U_TMS570LS0914_all/SDATA_ADF7021
EPWM2A: port SLE_ADF7021, sheet U_TMS570LS0914_all/EPWM2A, sheet U_TMS570LS0914_all/SLE_ADF7021
EPWM3A: port CLKOUT, sheet U_TMS570LS0914_all/EPWM3A, sheet U_TMS570LS0914_all/CLKOUT
EQEP2A: port EN_RF6886, sheet U_TMS570LS0914_all/EQEP2A, sheet U_TMS570LS0914_all/EN_RF6886
EQEP2I: port MUXOUT_ADF7021, sheet U_TMS570LS0914_all/EQEP2I, sheet U_TMS570LS0914_all/MUXOUT_ADF7021
GIOA0: port SREAD_ADF7021, sheet U_TMS570LS0914_all/SREAD_ADF7021
GIOA1: port SWD_ADF7021, sheet U_TMS570LS0914_all/SWD_ADF7021
GIOB0: port SCLK_ADF7021, sheet U_TMS570LS0914_all/SCLK_ADF7021
GIOB1: port #INT, sheet U_TMS570LS0914_all/#INT
GIOB2: port S_MAX33053E, sheet U_TMS570LS0914_all/S_MAX33053E
GIOB3: port TXRX_AS193, sheet U_TMS570LS0914_all/TXRX_AS193
N2HET1_24: port WDI, sheet U_TMS570LS0914_all/WDI
nERROR: port nERROR, sheet U_TMS570LS0914_all/nERROR
nPORRST: port nPORRST, sheet U_TMS570LS0914_all/nPORRST
nRST: port nRST, sheet U_TMS570LS0914_all/nRST

### Buses and harness runs
harness port CAN1 = sheet U_TMS570LS0914_all/CAN1
harness port I2C = sheet U_TMS570LS0914_all/I2C
harness port JTAG = sheet U_TMS570LS0914_all/JTAG
harness port MIBSPI1 = sheet U_TMS570LS0914_all/MIBSPI1
harness port MIBSPI3 = sheet U_TMS570LS0914_all/MIBSPI3
harness port MIBSPI5 = sheet U_TMS570LS0914_all/MIBSPI5
harness port SCI = sheet U_TMS570LS0914_all/SCI

### Notes on the sheet
- (the "License"); you may not use or redistribute this file except in compliance with the License. You
- This file and the information within it are licensed under the terms of the Apache License, Version 2.0
- Copyright
- Unless required by applicable law or agreed to in writing, content distributed under the License is
- distributed on an "AS IS" BASIS, WITHOUT WARRANTIES OR CONDITIONS OF ANY KIND,
- either express or implied. See the License for the specific language governing permissions and
- limitations under the License.
- may obtain a copy of the License at:
- http://www.apache.org/licenses/LICENSE-2.0
- Title
- Size:
- Date:
- Letter
- Number:
- Time:
- Revision:
- Sheet
- of
- University of Alberta
- Deptartment of Electrical
- and Computer Engineering
- Edmonton AB, Canada
- T6G 1H9
- File: